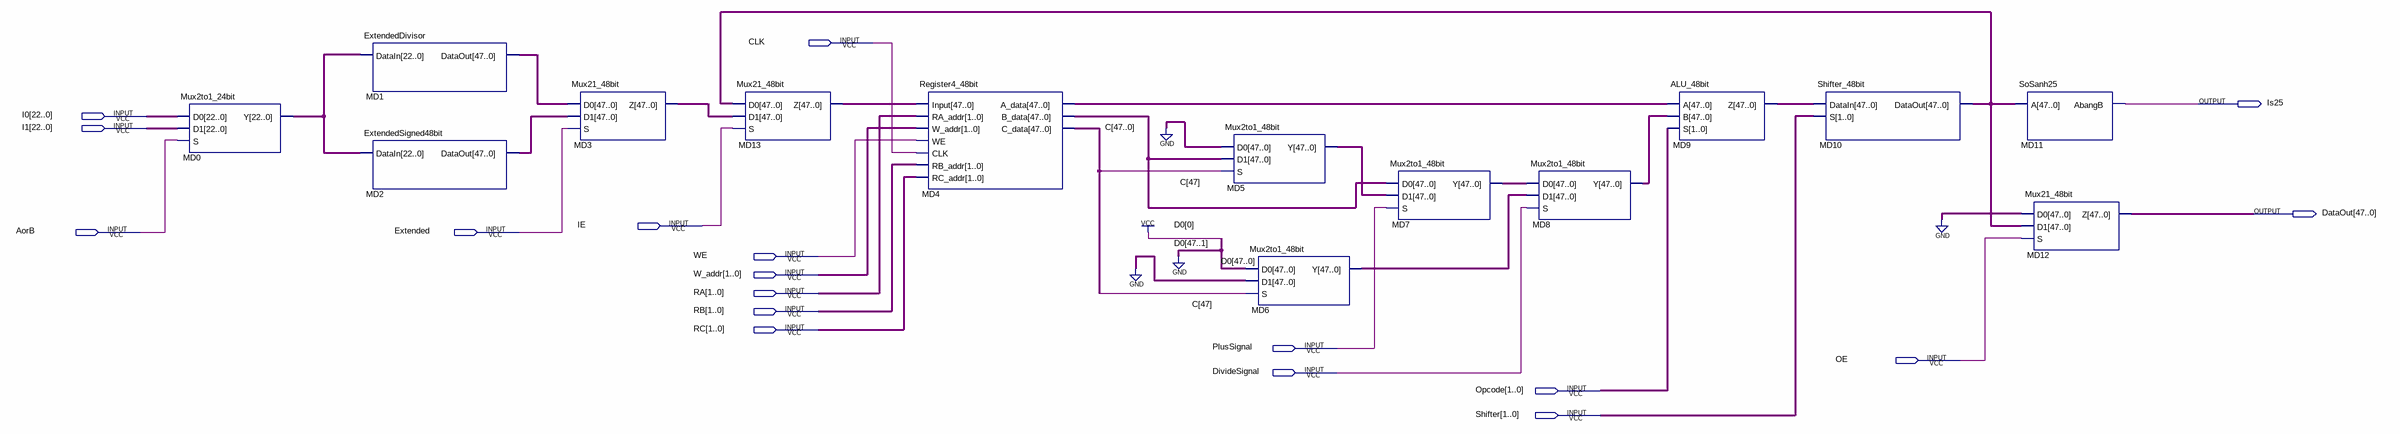
[diagram p0: schematic sheet]
// Quartus schematic DatapathDivision.bdf as structural Verilog: 14 symbols, 18 pins
module DatapathDivision (
  input  CLK,
  input  [22:0] I0,
  input  [22:0] I1,
  input  IE,
  input  AorB,
  input  Extended,
  input  WE,
  input  [1:0] W_addr,
  input  [1:0] RA,
  input  [1:0] RB,
  input  [1:0] RC,
  input  PlusSignal,
  input  OE,
  input  DivideSignal,
  input  [1:0] Opcode,
  input  [1:0] Shifter,
  output Is25,
  output [47:0] DataOut
);

  wire [22:0] MD0_y;
  wire [47:0] C, MD1_dataout, MD2_dataout, MD3_z, MD4_a_data, MD4_b_data, MD5_y, MD6_y, MD7_y, MD8_y, MD9_z,
       MD10_dataout, MD13_z;

  Mux2to1_24bit MD0 (.D0(I0), .D1(I1), .S(AorB), .Y(MD0_y));
  ExtendedDivisor MD1 (.DataIn(MD0_y), .DataOut(MD1_dataout));
  ExtendedSigned48bit MD2 (.DataIn(MD0_y), .DataOut(MD2_dataout));
  Mux21_48bit MD3 (.D0(MD1_dataout), .D1(MD2_dataout), .S(Extended), .Z(MD3_z));
  Mux21_48bit MD13 (.D0(MD10_dataout), .D1(MD3_z), .S(IE), .Z(MD13_z));
  Register4_48bit MD4 (
    .Input(MD13_z), .RA_addr(RA), .W_addr(W_addr), .WE(WE), .CLK(CLK), .RB_addr(RB), .RC_addr(RC),
    .A_data(MD4_a_data), .B_data(MD4_b_data), .C_data(C));
  Mux2to1_48bit MD5 (.D0({48{1'b0}}), .D1(MD4_b_data), .S(C[47]), .Y(MD5_y));
  Mux2to1_48bit MD6 (.D0(48'b000000000000000000000000000000000000000000000001), .D1({48{1'b0}}), .S(C[47]), .Y(MD6_y));
  Mux2to1_48bit MD7 (.D0(MD4_b_data), .D1(MD5_y), .S(PlusSignal), .Y(MD7_y));
  Mux2to1_48bit MD8 (.D0(MD7_y), .D1(MD6_y), .S(DivideSignal), .Y(MD8_y));
  ALU_48bit MD9 (.A(MD4_a_data), .B(MD8_y), .S(Opcode), .Z(MD9_z));
  Shifter_48bit MD10 (.DataIn(MD9_z), .S(Shifter), .DataOut(MD10_dataout));
  SoSanh25 MD11 (.A(MD10_dataout), .AbangB(Is25));
  Mux21_48bit MD12 (.D0({48{1'b0}}), .D1(MD10_dataout), .S(OE), .Z(DataOut));
endmodule
